# EAGLE board firefly-instrument-tray (EAGLE 7.7.0)
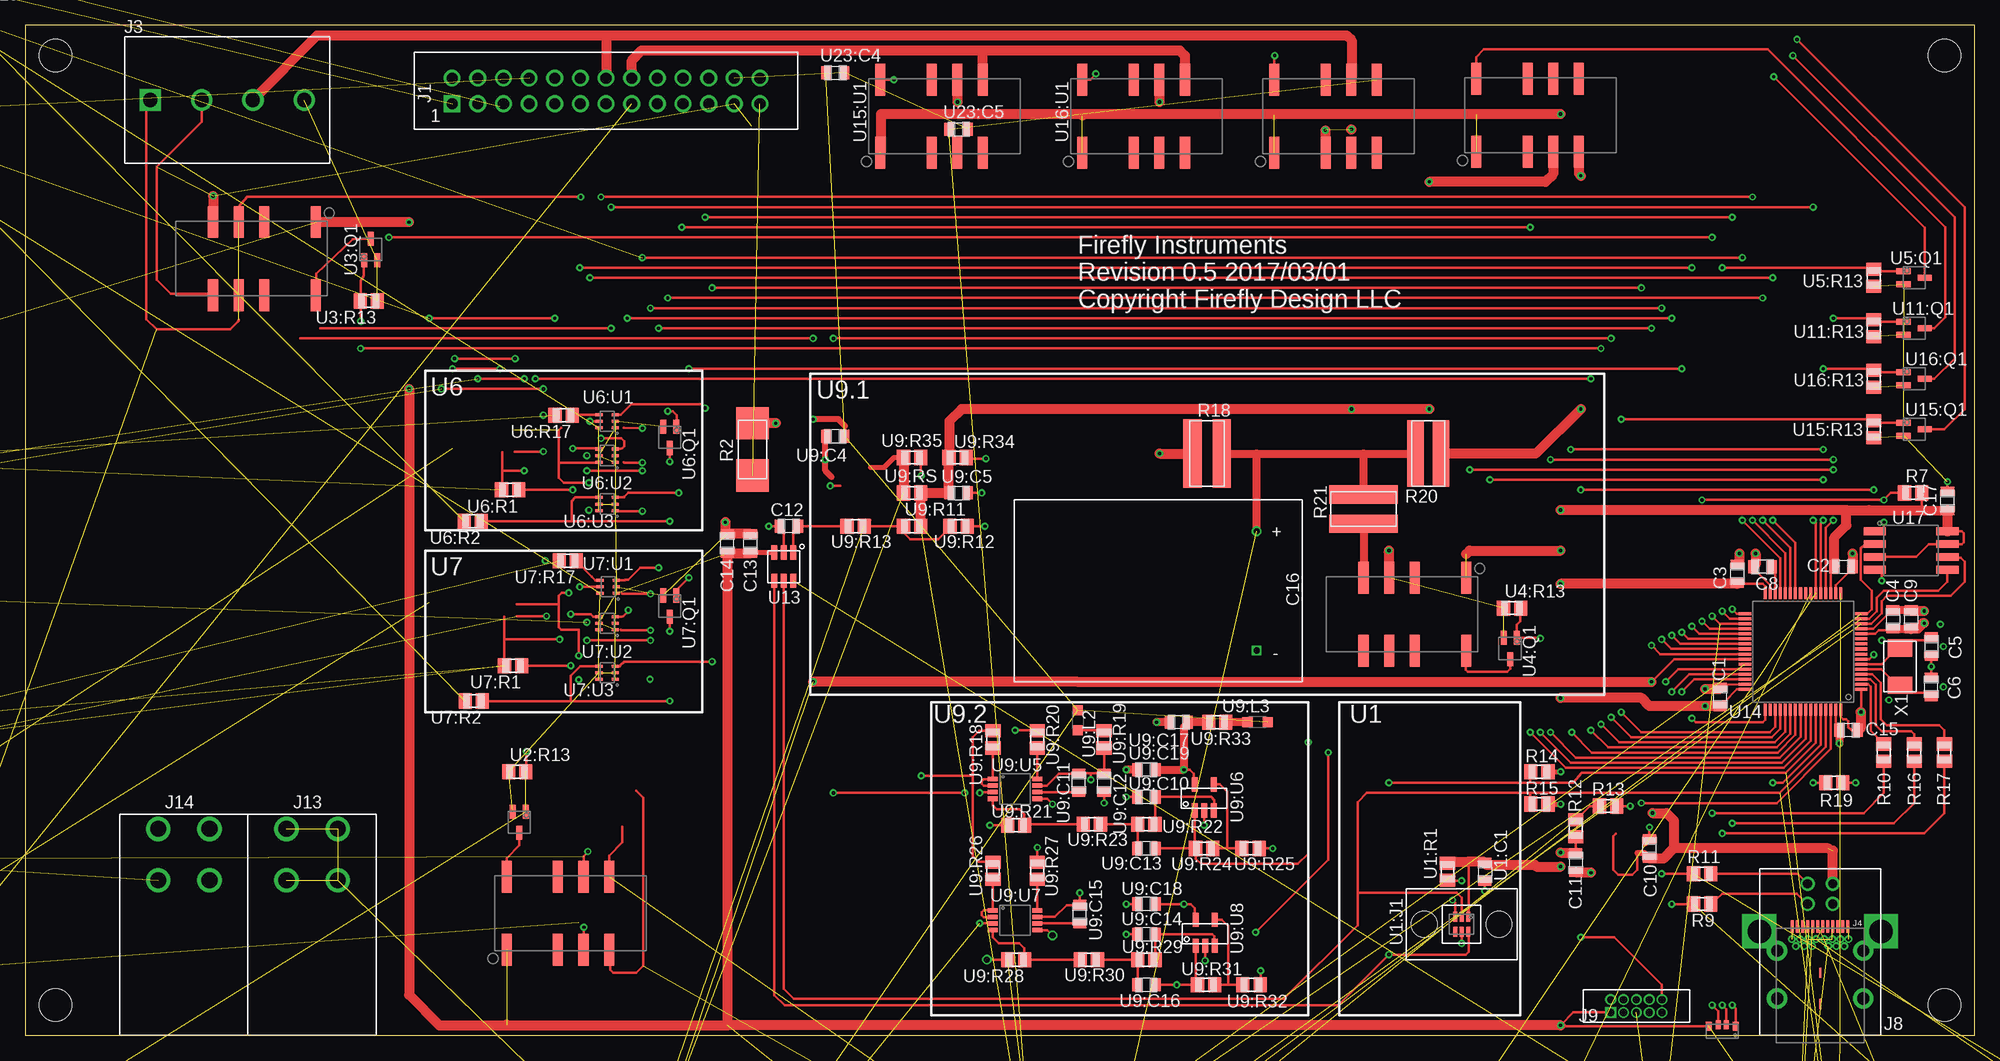
[diagram p14: board, top side]
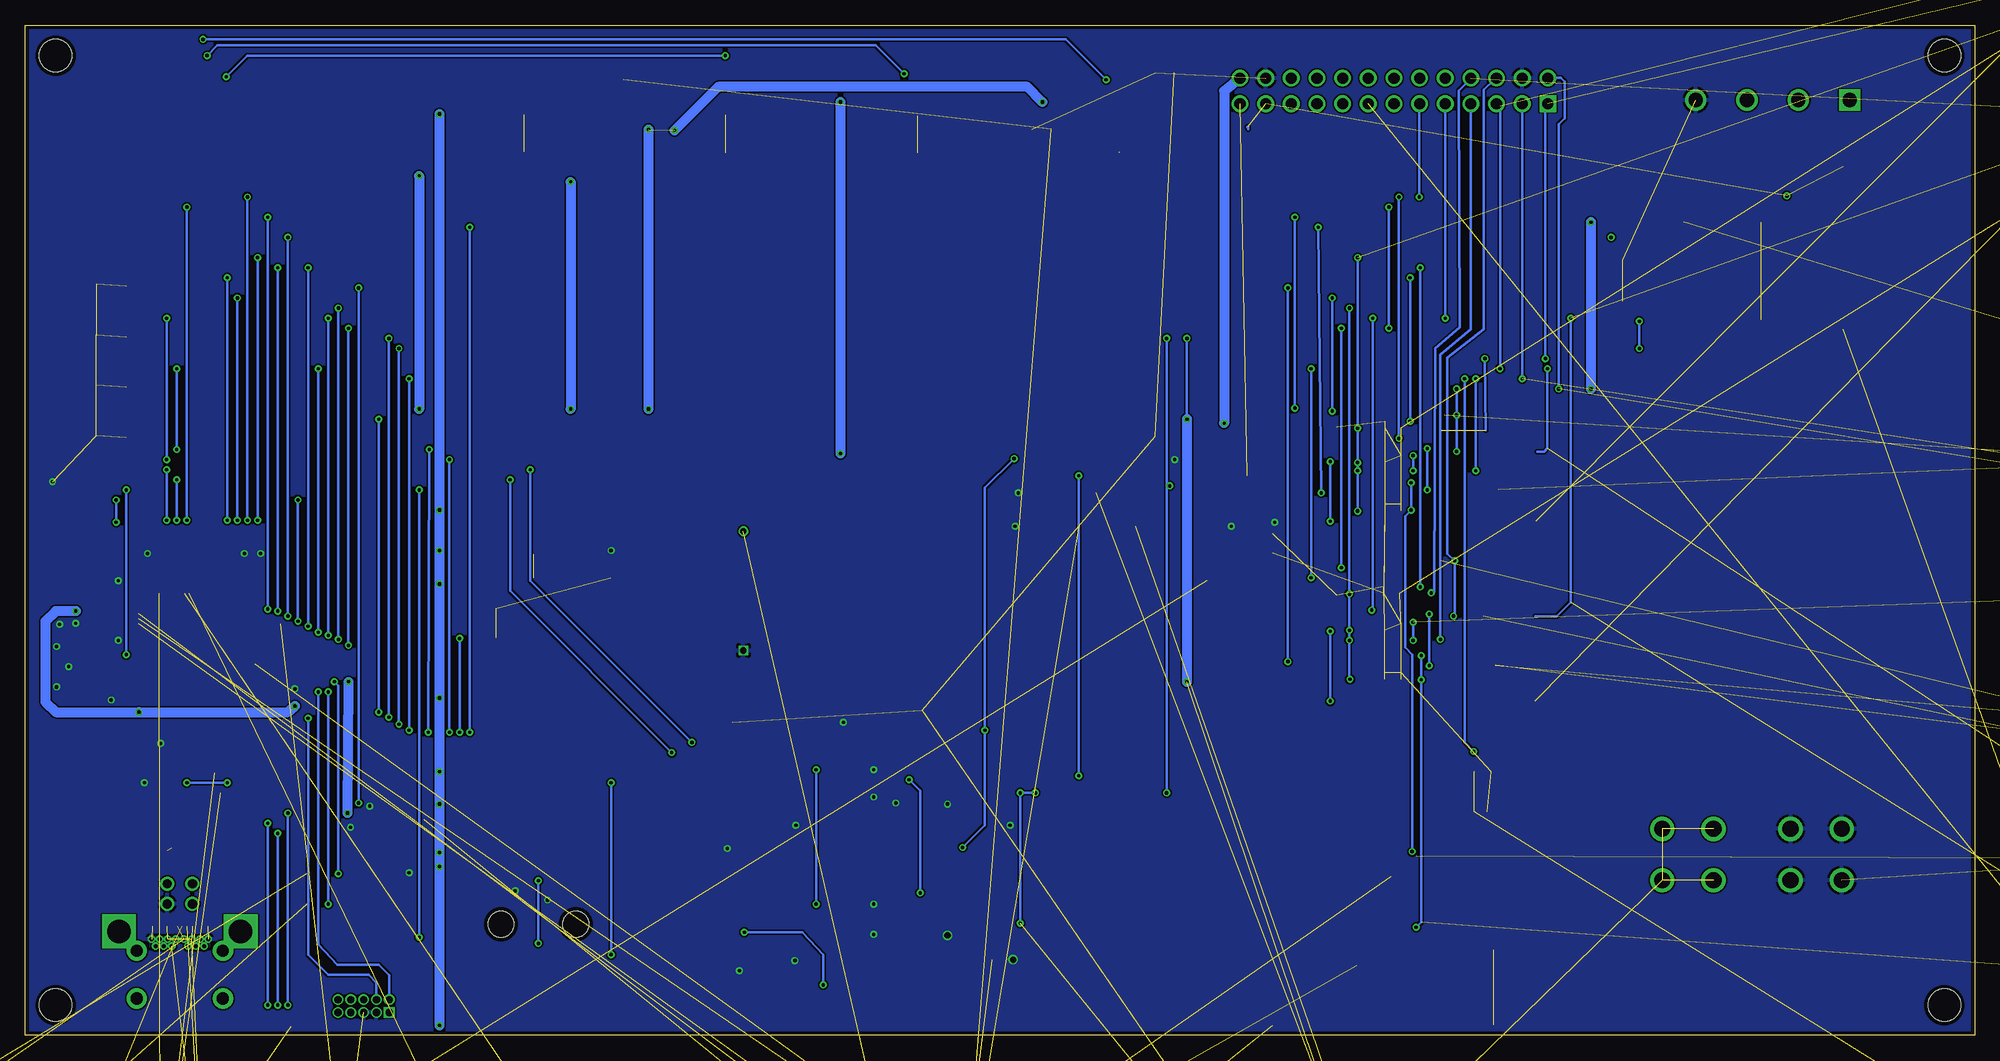
[diagram p15: board, bottom side, seen from below]

Size 193 x 100 mm. Coordinates in mm from the lower left corner, seen from the top.
Outline: 0,0 193,0 193,100 0,100 0,0
Copper layers (1*16): Top 0.0356mm / dielectric 1.5011mm / Bottom 0.0356mm
Design rules "LaenPCBOrder": minimum track width 6mil, minimum drill 13mil, track to track 6mil, track to pad 6mil, pad to pad 6mil, via to via 6mil, smd to smd 6mil, copper to edge 15mil, drill to drill 6mil, minimum pad ring 7mil, minimum via ring 7mil, stop-mask expansion 3mil, vias tented up to drill 0mil, thermal gap 10mil
Holes 3.2 mm at 3,3 3,97 190,3 190,97

## Footprints (pad centres in the part's own frame; a part is rotated, then mirrored left to right if it is on the bottom)
C0805 = smd 0.9 x 1.3: 1 -0.95,0; 2 0.95,0
PM118 = drill 0.6: + 0,-5.9 | drill 0.6 square: - 0,5.9
C1210 = smd 0.9 x 2.5: 1 -1.55,0; 2 1.55,0
C1206 = smd 0.9 x 1.6: 1 -1.55,0; 2 1.55,0
MSL0201RGB = smd 0.6 x 0.9: 1 -1.35,0; 4 1.35,0 | smd 0.5 x 0.9: 2 -0.4,-0.15; 3 0.4,-0.15
DO-214AB = smd 2 x 3.4: A 3.2,0; C -3.2,0
SMM4FXXA = smd 0.85 x 0.65: A 1.64,0 | smd 2.65 x 1.95: C -0.74,0
CON-HEADER-2X13 = drill 1.102 square: 1 -15.24,-1.27 | drill 1.102: 2 -15.24,1.27; 3 -12.7,-1.27; 4 -12.7,1.27; 5 -10.16,-1.27; 6 -10.16,1.27; 7 -7.62,-1.27; 8 -7.62,1.27; 9 -5.08,-1.27; 10 -5.08,1.27; 11 -2.54,-1.27; 12 -2.54,1.27; 13 0,-1.27; 14 0,1.27; 15 2.54,-1.27; 16 2.54,1.27; 17 5.08,-1.27; 18 5.08,1.27; 19 7.62,-1.27; 20 7.62,1.27; 21 10.16,-1.27; 22 10.16,1.27; 23 12.7,-1.27; 24 12.7,1.27; 25 15.24,-1.27; 26 15.24,1.27
282847-4 = drill 1.4 square: 1 -7.62,0 | drill 1.4: 2 -2.54,0; 3 2.54,0; 4 7.62,0
AUSB1-DFN-PTR3 = smd 0.3 x 1.2: A1 -2.75,10.58; A2 -2.25,10.58; A3 -1.75,10.58; A4 -1.25,10.58; A5 -0.75,10.58; A6 -0.25,10.58; A7 0.25,10.58; A8 0.75,10.58; A9 1.25,10.58; A10 1.75,10.58; A11 2.25,10.58; A12 2.75,10.58 | drill 0.4 pad 0.65: B1 2.8,9.33; B2 2.4,8.63; B3 1.6,8.63; B4 1.2,9.33; B5 0.8,8.63; B6 0.4,9.33; B7 -0.4,9.33; B8 -0.8,8.63; B9 -1.2,9.33; B10 -1.6,8.63; B11 -2.4,8.63; B12 -2.8,9.33; GNDP1 2,9.33; GNDP2 -2,9.33 | drill 1.2 pad 2: MP1 4.27,8.18; MP2 4.27,3.45; MP3 -4.27,3.45; MP4 -4.27,8.18 | smd 0.2 x 1: MP5 0,6; MP6 0,2.9
USB-B1HSB6 = drill 0.92: 1 1.25,4.71; 2 -1.25,4.71; 3 -1.25,2.71; 4 1.25,2.71 | drill 2.33 square: MA -6.02,0; MB 6.02,0
SWD-10 = drill 0.7 pad 1 square: 1 -2.54,-0.635 | drill 0.7 pad 1: 2 -2.54,0.635; 3 -1.27,-0.635; 4 -1.27,0.635; 5 0,-0.635; 6 0,0.635; 7 1.27,-0.635; 8 1.27,0.635; 9 2.54,-0.635; 10 2.54,0.635
CT3151 = drill 1.6: 1 -2.54,2.54; 2 -2.54,-2.54; 3 2.54,-2.54; 4 2.54,2.54
SDR0805 = smd 8 x 2.7: 1 0,2.65; 2 0,-2.65
R0805 = smd 1.3 x 1.5: 1 -0.85,0; 2 0.85,0
RW0S6BB = smd 3.18 x 3.2: 1 -2.58,0; 2 2.58,0
RCL1225 = smd 1.8 x 6.8: 1 -1.45,0; 2 1.45,0
KRL6432 = smd 1.65 x 6.6: 1 -1.275,0; 2 1.275,0
SMFLP = hole 2.57: 0,3.7; 0,-3.7
DFN6 = smd 1 x 0.4: 1 -0.75,0.65; 2 -0.75,0; 3 -0.75,-0.65; 4 0.75,-0.65; 5 0.75,0; 6 0.75,0.65
MCPH3 = smd 1.4 x 0.6: 1 -1.05,0.65; 2 -1.05,-0.65; 3 1.05,0
TXS2SA = smd 3.16 x 1: 1 -3.62,6.35; 3 -3.62,1.27; 4 -3.62,-1.27; 5 -3.62,-3.81; 8 3.62,-3.81; 9 3.62,-1.27; 10 3.62,1.27; 12 3.62,6.35
SOT363 = smd 0.7 x 0.3: 1 -0.8,0.65; 2 -0.8,0; 3 -0.8,-0.65; 4 0.8,-0.65; 5 0.8,0; 6 0.8,0.65
R-PDSO-G8 = smd 1.55 x 0.6: 1 -2.7,1.905; 2 -2.7,0.635; 3 -2.7,-0.635; 4 -2.7,-1.905; 5 2.7,-1.905; 6 2.7,-0.635; 7 2.7,0.635; 8 2.7,1.905
L2012C = smd 1 x 1: 1 -1,0; 2 1,0
PPAK = smd 3 x 0.76: 1 -6.65,2.62; 2 -6.65,1.35; 4 -6.65,-1.35; 5 -6.65,-2.62 | smd 6.7 x 6.7: TAB 0,0
MSOP8 = smd 1 x 0.45: 1 -2.2,0.975; 2 -2.2,0.325; 3 -2.2,-0.325; 4 -2.2,-0.975; 5 2.2,-0.975; 6 2.2,-0.325; 7 2.2,0.325; 8 2.2,0.975
SOT-23-5 = smd 1.4 x 0.6: 1 -1.24,0.94; 2 -1.24,-0.01; 3 -1.24,-0.96; 4 1.34,-0.96; 5 1.34,0.94
SOT-23-6 = smd 1.4 x 0.6: 1 -1.4,0.95; 2 -1.4,0; 3 -1.4,-0.95; 4 1.4,-0.95; 5 1.4,0; 6 1.4,0.95
LQFP-64 = smd 1.2 x 0.3: 1 -5.75,3.75; 2 -5.75,3.25; 3 -5.75,2.75; 4 -5.75,2.25; 5 -5.75,1.75; 6 -5.75,1.25; 7 -5.75,0.75; 8 -5.75,0.25; 9 -5.75,-0.25; 10 -5.75,-0.75; 11 -5.75,-1.25; 12 -5.75,-1.75; 13 -5.75,-2.25; 14 -5.75,-2.75; 15 -5.75,-3.25; 16 -5.75,-3.75; 33 5.75,-3.75; 34 5.75,-3.25; 35 5.75,-2.75; 36 5.75,-2.25; 37 5.75,-1.75; 38 5.75,-1.25; 39 5.75,-0.75; 40 5.75,-0.25; 41 5.75,0.25; 42 5.75,0.75; 43 5.75,1.25; 44 5.75,1.75; 45 5.75,2.25; 46 5.75,2.75; 47 5.75,3.25; 48 5.75,3.75 | smd 0.3 x 1.2: 17 -3.75,-5.75; 18 -3.25,-5.75; 19 -2.75,-5.75; 20 -2.25,-5.75; 21 -1.75,-5.75; 22 -1.25,-5.75; 23 -0.75,-5.75; 24 -0.25,-5.75; 25 0.25,-5.75; 26 0.75,-5.75; 27 1.25,-5.75; 28 1.75,-5.75; 29 2.25,-5.75; 30 2.75,-5.75; 31 3.25,-5.75; 32 3.75,-5.75; 49 3.75,5.75; 50 3.25,5.75; 51 2.75,5.75; 52 2.25,5.75; 53 1.75,5.75; 54 1.25,5.75; 55 0.75,5.75; 56 0.25,5.75; 57 -0.25,5.75; 58 -0.75,5.75; 59 -1.25,5.75; 60 -1.75,5.75; 61 -2.25,5.75; 62 -2.75,5.75; 63 -3.25,5.75; 64 -3.75,5.75
SOC008 = smd 2.2 x 0.76: 1 -3.6,1.905; 2 -3.6,0.635; 3 -3.6,-0.635; 4 -3.6,-1.905; 5 3.6,-1.905; 6 3.6,-0.635; 7 3.6,0.635; 8 3.6,1.905
HVQFN20 = smd 0.9 x 0.27: 1 -2.15,1; 2 -2.15,0.5; 3 -2.15,0; 4 -2.15,-0.5; 5 -2.15,-1; 11 2.15,-1; 12 2.15,-0.5; 13 2.15,0; 14 2.15,0.5; 15 2.15,1 | smd 0.27 x 0.9: 6 -1,-2.15; 7 -0.5,-2.15; 8 0,-2.15; 9 0.5,-2.15; 10 1,-2.15; 16 1,2.15; 17 0.5,2.15; 18 0,2.15; 19 -0.5,2.15; 20 -1,2.15 | smd 2.8 x 2.8: PGND 0,0
TSSOP-20 = smd 1.05 x 0.32: 1 -2.9,2.925; 2 -2.9,2.275; 3 -2.9,1.625; 4 -2.9,0.975; 5 -2.9,0.325; 6 -2.9,-0.325; 7 -2.9,-0.975; 8 -2.9,-1.625; 9 -2.9,-2.275; 10 -2.9,-2.925; 11 2.9,-2.925; 12 2.9,-2.275; 13 2.9,-1.625; 14 2.9,-0.975; 15 2.9,-0.325; 16 2.9,0.325; 17 2.9,0.975; 18 2.9,1.625; 19 2.9,2.275; 20 2.9,2.925
TXC_7A = smd 1.7 x 2.4: 1 -1.85,0; 2 1.85,0

## Placement (x,y rotation side)
C1  100nF  [C0805]  167.8,33.5 90 top
C2  100nF  [C0805]  180,46.4 0 top
C3  100nF  [C0805]  169.5,45.7 90 top
C4  1uF  [C0805]  184.9,41.2 270 top
C5  22pF  [C0805]  188.7,38.5 270 top
C6  22pF  [C0805]  188.7,34.5 90 top
C7  2.2uF  [C0805]  not placed on the board
C8  4.7uF  [C0805]  172,46.4 180 top
C9  10nF  [C0805]  186.7,41.2 270 top
C10  1uF  [C0805]  160.8,18.5 90 top
C11  1uF  [C0805]  153.5,17.1 270 top
C12  100nF  [C0805]  75.6,50.4 180 top
C13  100nF  [C0805]  71.8,48.7 90 top
C14  10uF  [C0805]  69.5,48.7 90 top
C15  100nF  [C0805]  180.5,30.2 180 top
C16  1F  [PM118]  121.9,44 180 top
C17  100nF  [C0805]  190.3,52.9 90 top
C18  2.2uF  [C0805]  not placed on the board
C19  100nF  [C0805]  not placed on the board
C20  100nF  [C0805]  not placed on the board
C21  100nF  [C0805]  not placed on the board
C22  4.7uF  [C1210]  not placed on the board
C23  8.2nF  [C0805]  not placed on the board
C24  300pF  [C0805]  not placed on the board
C25  5.6nF  [C0805]  not placed on the board
C26  100nF  [C0805]  not placed on the board
C27  47uF  [C1206]  not placed on the board
C28  4.7uF  [C1210]  not placed on the board
C29  2.2uF  [C0805]  not placed on the board
C30  2.2uF  [C0805]  not placed on the board
C31  100nF  [C0805]  not placed on the board
C32  100nF  [C0805]  not placed on the board
C33  10uF  [C0805]  not placed on the board
C34  2.2uF  [C0805]  not placed on the board
C35  2.2uF  [C0805]  not placed on the board
C36  4.7uF  [C1210]  not placed on the board
C37  8.2nF  [C0805]  not placed on the board
C38  300pF  [C0805]  not placed on the board
C39  5.6nF  [C0805]  not placed on the board
C40  100nF  [C0805]  not placed on the board
C41  47uF  [C1206]  not placed on the board
C42  4.7uF  [C1210]  not placed on the board
C43  100nF  [C0805]  not placed on the board
C44  10uF  [C0805]  not placed on the board
C45  100nF  [C0805]  not placed on the board
C46  10uF  [C0805]  not placed on the board
C47  100nF  [C0805]  not placed on the board
C48  10uF  [C0805]  not placed on the board
C49  2.2uF  [C0805]  not placed on the board
C50  1uF  [C0805]  not placed on the board
D1  LED-RGB-CAMSL0201RGB  [MSL0201RGB]  168,0.9 180 top
D2  D-USDO-214AB  [DO-214AB]  not placed on the board
D3  D-USSMM4FXXA  [SMM4FXXA]  not placed on the board
D4  D-USSMM4FXXA  [SMM4FXXA]  not placed on the board
D5  D-USSMM4FXXA  [SMM4FXXA]  not placed on the board
D6  D-USSMM4FXXA  [SMM4FXXA]  not placed on the board
D7  D-USDO-214AB  [DO-214AB]  not placed on the board
J1  CON-26  [CON-HEADER-2X13]  57.5,93.5 0 top
J3  CON-4282847-4  [282847-4]  20,92.6 0 top
J4  USB-CAUSB1-DFN-PTR3  [AUSB1-DFN-PTR3]  177.7,0.2 0 top
J8  USB-4PINUSB-B1HSB6  [USB-B1HSB6]  177.7,10.3 0 top
J9  CON-10SWD  [SWD-10]  159.5,2.9 0 top
J13  CON-1CT3151  [CT3151]  28.4,17.9 180 top
J14  CON-1CT3151  [CT3151]  15.7,17.9 180 top
L1  6.8uH  [SDR0805]  not placed on the board
L2  6.8uH  [SDR0805]  not placed on the board
R1  169k  [R0805]  not placed on the board
R2  100  [RW0S6BB]  72,58 270 top
R7  10k  [R0805]  186.9,53.7 0 top
R8  22  [R0805]  not placed on the board
R9  22  [R0805]  166,13 0 top
R10  60  [R0805]  184,28 90 top
R11  22  [R0805]  166,16 0 top
R12  72.5k  [R0805]  153.5,20.5 270 top
R13  10K  [R0805]  156.7,22.7 180 top
R14  4.7k  [R0805]  149.9,26.1 0 top
R15  4.7k  [R0805]  149.9,22.9 0 top
R16  60  [R0805]  187,28 90 top
R17  240  [R0805]  190,28 90 top
R18  1 (2W WW)  [RCL1225]  117,57.6 0 top
R19  0  [R0805]  179.1,25 0 top
R20  49.9 (2W WW)  [KRL6432]  138.9,57.6 180 top
R21  49.9 (2W WW)  [RCL1225]  132.5,52.1 90 top
R22  22  [R0805]  not placed on the board
R23  10K  [R0805]  not placed on the board
R24  169k  [R0805]  not placed on the board
R25  29.4k  [R0805]  not placed on the board
R26  43  [R0805]  not placed on the board
R27  1  [R0805]  not placed on the board
R28  10.2k  [R0805]  not placed on the board
R29  3.28k  [R0805]  not placed on the board
R30  76.8k  [R0805]  not placed on the board
R31  43  [R0805]  not placed on the board
R32  29.4k  [R0805]  not placed on the board
R33  1  [R0805]  not placed on the board
R34  10.2k  [R0805]  not placed on the board
R35  1.6k  [R0805]  not placed on the board
R36  76.8k  [R0805]  not placed on the board
R37  10.2k  [R0805]  not placed on the board
R38  1.47k  [R0805]  not placed on the board
U1:C1  1uF  [C0805]  144.5,16.2 270 top
U1:J1  SMFLP  [SMFLP]  142.2,11 90 top
U1:R1  10k  [R0805]  140.8,16.2 90 top
U1:U1  TCS3471  [DFN6]  142.2,11 270 top
U2:Q1  FET-NMCPH3  [MCPH3]  48.9,21.1 270 top
U2:R13  10K  [R0805]  48.7,26.1 0 top
U2:U1  TXS2SA  [TXS2SA]  54,12.1 90 top
U3:Q1  FET-NMCPH3  [MCPH3]  34.2,77.8 90 top
U3:R13  10K  [R0805]  34,72.7 180 top
U3:U1  TXS2SA  [TXS2SA]  22.4,76.9 270 top
U4:Q1  FET-NMCPH3  [MCPH3]  147,38.3 270 top
U4:R13  10K  [R0805]  147.2,42.3 0 top
U4:U1  TXS2SA  [TXS2SA]  136.3,41.7 270 top
U5:Q1  FET-NMCPH3  [MCPH3]  187,75 0 top
U5:R13  10K  [R0805]  183,75 90 top
U5:U1  TXS2SA  [TXS2SA]  130,91 90 top
U6:J7  CON-10SWD  [SWD-10]  not placed on the board
U6:Q1  FET-NMCPH3  [MCPH3]  63.8,59.2 270 top
U6:R1  240  [R0805]  48,54 180 top
U6:R2  240  [R0805]  44.3,50.9 180 top
U6:R17  240  [R0805]  53.3,61.4 180 top
U6:U1  74LVCH1T45  [SOT363]  57.6,60.8 180 top
U6:U2  74LVCH1T45  [SOT363]  57.6,57.4 180 top
U6:U3  74LVCH1T45  [SOT363]  57.6,52.6 180 top
U6:U4:Q1  FET-NMCPH3  [MCPH3]  not placed on the board
U6:U4:R13  10K  [R0805]  not placed on the board
U6:U4:U1  TXS2SA  [TXS2SA]  not placed on the board
U6:U5:Q1  FET-NMCPH3  [MCPH3]  not placed on the board
U6:U5:R13  10K  [R0805]  not placed on the board
U6:U5:U1  TXS2SA  [TXS2SA]  not placed on the board
U7:J7  CON-10SWD  [SWD-10]  not placed on the board
U7:Q1  FET-NMCPH3  [MCPH3]  63.8,42.5 270 top
U7:R1  240  [R0805]  48.3,36.6 180 top
U7:R2  240  [R0805]  44.4,33.1 180 top
U7:R17  240  [R0805]  53.7,47 180 top
U7:U1  74LVCH1T45  [SOT363]  57.7,44.4 180 top
U7:U2  74LVCH1T45  [SOT363]  57.6,40.8 180 top
U7:U3  74LVCH1T45  [SOT363]  57.6,35.9 180 top
U7:U4:Q1  FET-NMCPH3  [MCPH3]  not placed on the board
U7:U4:R13  10K  [R0805]  not placed on the board
U7:U4:U1  TXS2SA  [TXS2SA]  not placed on the board
U7:U5:Q1  FET-NMCPH3  [MCPH3]  not placed on the board
U7:U5:R13  10K  [R0805]  not placed on the board
U7:U5:U1  TXS2SA  [TXS2SA]  not placed on the board
U8  TPS54232  [R-PDSO-G8]  not placed on the board
U9:C4  1uF  [C0805]  80.2,59.3 180 top
U9:C5  1uF  [C0805]  92.4,53.7 0 top
U9:C10  1nF  [C0805]  111,23.6 180 top
U9:C11  100nF  [C0805]  104.3,25 90 top
U9:C12  10uF  [C0805]  106.8,25 270 top
U9:C13  1nF  [C0805]  111,18.5 180 top
U9:C14  1nF  [C0805]  111,10 180 top
U9:C15  100nF  [C0805]  104.4,12 90 top
U9:C16  1nF  [C0805]  111,5 180 top
U9:C17  1uF  [C0805]  114.2,31 180 top
U9:C18  100nF  [C0805]  111,13 180 top
U9:C19  100nF  [C0805]  111,26.3 180 top
U9:L2  1k  [L2012C]  104.2,31.2 270 top
U9:L3  1k  [L2012C]  122,31 180 top
U9:R11  650K  [R0805]  87.8,50.4 0 top
U9:R12  100K  [R0805]  92.4,50.4 180 top
U9:R13  100K  [R0805]  82.2,50.4 0 top
U9:R18  1.8K  [R0805]  95.8,29.3 90 top
U9:R19  0  [R0805]  106.8,29.3 90 top
U9:R20  43  [R0805]  100.2,29.3 270 top
U9:R21  12K  [R0805]  98.1,20.8 180 top
U9:R22  10k  [R0805]  111,20.9 0 top
U9:R23  10k  [R0805]  105.6,20.9 0 top
U9:R24  376  [R0805]  116.7,18.5 180 top
U9:R25  1K  [R0805]  121.3,18.5 0 top
U9:R26  4.7  [R0805]  95.8,16.3 90 top
U9:R27  0  [R0805]  100.2,16.3 270 top
U9:R28  10K  [R0805]  98.1,7.5 180 top
U9:R29  10k  [R0805]  111,7.5 0 top
U9:R30  10k  [R0805]  105.3,7.5 0 top
U9:R31  0  [R0805]  116.9,5 180 top
U9:R32  1K  [R0805]  121.4,5 0 top
U9:R33  1  [R0805]  118,31 0 top
U9:R34  0  [R0805]  92.3,57.2 180 top
U9:R35  0  [R0805]  87.8,57.2 180 top
U9:RS  4.7  [R0805]  87.8,53.7 0 top
U9:U2  VREG-ADJLDFMPT-TR  [PPAK]  not placed on the board
U9:U5  LTC6102-1MS8  [MSOP8]  98,24.4 0 top
U9:U6  TLV271SN2T1G  [SOT-23-5]  116.7,23.5 90 top
U9:U7  LTC6102-1MS8  [MSOP8]  98,11.4 0 top
U9:U8  TLV271SN2T1G  [SOT-23-5]  116.8,10.1 90 top
U10:Q1  FET-NMCPH3  [MCPH3]  not placed on the board
U10:R13  10K  [R0805]  not placed on the board
U10:U1  TXS2SA  [TXS2SA]  not placed on the board
U11:Q1  FET-NMCPH3  [MCPH3]  187,70 0 top
U11:R13  10K  [R0805]  183,70 90 top
U11:U1  TXS2SA  [TXS2SA]  150,91.1 90 top
U12  VREG-ADJAP7331-WG-7  [SOT-23-5]  not placed on the board
U13  MCP47X6  [SOT-23-6]  75.1,46.4 270 top
U14  STM32F411-LQFP64  [LQFP-64]  176,38 180 top
U15:Q1  FET-NMCPH3  [MCPH3]  187,60 0 top
U15:R13  10K  [R0805]  183,60 90 top
U15:U1  TXS2SA  [TXS2SA]  91,91 90 top
U16:Q1  FET-NMCPH3  [MCPH3]  187,65 0 top
U16:R13  10K  [R0805]  183,65 90 top
U16:U1  TXS2SA  [TXS2SA]  111,91 90 top
U17  MEMORY-SPISOC008  [SOC008]  186.7,48 0 top
U18  PTN5100  [HVQFN20]  not placed on the board
U19  TPS54232  [R-PDSO-G8]  not placed on the board
U20  MCP1501  [SOT-23-6]  not placed on the board
U21  MCP47X6  [SOT-23-6]  not placed on the board
U22  MCP1501  [SOT-23-6]  not placed on the board
U23:C4  1uF  [C0805]  80.2,95.3 0 top
U23:C5  1uF  [C0805]  92.4,89.7 0 top
U23:C10  1nF  [C0805]  not placed on the board
U23:C11  100nF  [C0805]  not placed on the board
U23:C12  10uF  [C0805]  not placed on the board
U23:C13  1nF  [C0805]  not placed on the board
U23:C14  1nF  [C0805]  not placed on the board
U23:C15  100nF  [C0805]  not placed on the board
U23:C16  1nF  [C0805]  not placed on the board
U23:C17  1uF  [C0805]  not placed on the board
U23:C18  100nF  [C0805]  not placed on the board
U23:C19  100nF  [C0805]  not placed on the board
U23:L2  1k  [L2012C]  not placed on the board
U23:L3  1k  [L2012C]  not placed on the board
U23:R11  650K  [R0805]  not placed on the board
U23:R12  100K  [R0805]  not placed on the board
U23:R13  100K  [R0805]  not placed on the board
U23:R18  1.8K  [R0805]  not placed on the board
U23:R19  0  [R0805]  not placed on the board
U23:R20  43  [R0805]  not placed on the board
U23:R21  12K  [R0805]  not placed on the board
U23:R22  10k  [R0805]  not placed on the board
U23:R23  10k  [R0805]  not placed on the board
U23:R24  376  [R0805]  not placed on the board
U23:R25  1K  [R0805]  not placed on the board
U23:R26  4.7  [R0805]  not placed on the board
U23:R27  0  [R0805]  not placed on the board
U23:R28  10K  [R0805]  not placed on the board
U23:R29  10k  [R0805]  not placed on the board
U23:R30  10k  [R0805]  not placed on the board
U23:R31  0  [R0805]  not placed on the board
U23:R32  1K  [R0805]  not placed on the board
U23:R33  1  [R0805]  not placed on the board
U23:R34  0  [R0805]  not placed on the board
U23:R35  0  [R0805]  not placed on the board
U23:RS  4.7  [R0805]  not placed on the board
U23:U2  VREG-ADJLDFMPT-TR  [PPAK]  not placed on the board
U23:U5  LTC6102-1MS8  [MSOP8]  not placed on the board
U23:U6  TLV271SN2T1G  [SOT-23-5]  not placed on the board
U23:U7  LTC6102-1MS8  [MSOP8]  not placed on the board
U23:U8  TLV271SN2T1G  [SOT-23-5]  not placed on the board
U24  AD7327  [TSSOP-20]  not placed on the board
U25  VREG-ADJAP2204  [SOT-23-5]  not placed on the board
X1  XTAL2TXC_7A  [TXC_7A]  185.6,36.5 90 top

## Tracks (layer width: path | path; a pad name or v marks a point on that pad's centre or on a via)
+3V3  (via drill 0.33)  (45 unrouted)
  Top 0.254: U1:U1.1 142.85,12.35 142.9,12.4 142.9,17.2 | U1:R1.2 140.85,17.2 | 144.3,17.2 U1:C1.1 144.55,16.95 144.6,16.9 | 71.85,47.8 C13.1 | C11.1 | C11.1 R12.2 153.35,19.65 153.2,19.5 | U14.1 v181.75,32 | U14.13 182.95,40.25 184.8,42.1 C4.1 | U14.48 169.45,34.25 168.3,33.1 168.05,33.1 C1.1 167.75,32.55 167.7,32.6 | U14.19 178.75,46.15 179,46.4 C2.1 179.1,46.45 | J9.1 153.26,2.27 v152,1 152,1.4 152.5,0.9 D1.4 | 153.5,18.1 C11.1 | U14.32 172.25,44.45 172,44.7 169.55,44.7 C3.1 169.45,44.7 | 186.85,42 C9.1 | U14.64 179.75,31.55 180,31.3 180.3,31.3 180.5,31.1 180.5,30.5 180.8,30.2 C15.1 | U17.8 191.69,49.91 191.9,49.7 191.9,48.8 191.7,48.6 190.34,48.6 U17.7 188.44,48.63 187.2,47.4 185.13,47.4 U17.3 | R7.2 187.75,52.01 187.8,51.97
  Top 0.5: U13.3 71.85,47.8 | R15.2 v152,22.9 | R14.2 v152,26.1
  Top 0.813: C4.1 C9.1
  Top 1: 140.85,17.2 142.9,17.2 144.3,17.2 | 47.7,1 41,1 38,4 v38,64 | 47.7,1 69.5,1 | v152,1 69.5,1 | 144.6,16.9 149.4,16.9 149.6,16.7 v152,16.7 | C13.1 C14.1 69.5,1 | v152,18.1 153.5,18.1 | 167.7,32.6 v166.3,32.6 160.8,32.6 160,33.4 v152,33.4 | v181.75,32 181.7,32 181.7,30.4 C15.1 | v188,42 186.85,42 | 179.1,46.45 179.1,49.3 180.3,50.5 180.3,52 | 180.3,52 v152,52 | 169.45,44.7 v152,44.7 | 47.65,1.05 47.7,1 | v38,80.5 28.8,80.5 | U17.8 C17.1 187.8,51.97 182.55,52 180.3,52 | v152,91.2 143.7,91.2 | 143.7,91.2 123.7,91.2 | 123.7,91.2 104.5,91.2 | 104.5,91.2 84.7,91.2 84.7,87.43 | 104.65,91.05 104.5,91.2 | 123.65,91.15 123.7,91.2 | 143.65,91.15 143.7,91.2 | 142.65,47.65 143,48 v152,48
  Bottom 0.254: 152,51.7 v152,52
  Bottom 1: v152,1 v152,16.7 v152,18.1 v152,22.9 v152,26.1 v152,33.4 v152,44.7 v152,48 v152,52 v152,91.2 | v166.3,32.6 167,32 v181.75,32 190,32 191,33 191,41 190,42 v188,42 | v38,80.5 v38,64
+5V9  (10 unrouted)
+12V  (14 unrouted)
ADC_CSN  (1 unrouted)
ATE_BAT_ADJ_EN  (via drill 0.33)
  Top 0.254: U14.51 173.25,30.55 172.7,30 160,30 v158,32 | v158,61 182.85,61 U15:R13.2 183.2,60.65 U15:Q1.1
  Bottom 0.254: v158,32 v158,61
ATE_BAT_CAP_EN  (via drill 0.33)
  Top 0.254: U14.55 175.25,29.75 173.5,28 155.1,28 v153.1,30 | U16:Q1.1 183.2,65.65 U16:R13.2 182.85,66 v178,66 | v153,58 v178,58
  Bottom 0.254: v153.1,30 v153,58 | v178,58 v178,66
ATE_BS_ADJ
  Top 0.254: U13.1 76.05,49.9 C12.1 U9:R13.1
ATE_BS_EN  (via drill 0.33)  (1 unrouted)
  Top 0.254: U9:U5.3 94.7,24.07 94.7,24 v94.5,24 | v94.5,11.1 95.78,11.1 U9:U7.3 | v93,24 v80,24 | v157,69 v80,69 | v157,31.5 159,29.5 172.9,29.5 173.75,30.35 U14.52 | 80.7,54.4 v79.7,54.4
  Bottom 0.254: v94.5,11.1 v94.5,24 v93,24 | v80,24 80,54.4 | 80,54.4 v80,69 | v157,31.5 v157,69 | v79.7,54.4 80,54.4
ATE_BS_SHR  (via drill 0.33)
  Top 0.254: U9:C13.1 U9:R24.2 | U9:R24.2 115.9,18.5 115.9,17.5 116.4,17 126,17 127,18 v127,29 | v143,56 v179,56 | U14.20 178.25,50.25 v179,51 | U9:U6.1 115.76,18.59 U9:R24.2
  Bottom 0.254: v143,56 143,45 v127,29 | v179,51 v179,56
ATE_BS_SLR  (via drill 0.33)
  Top 0.254: U9:C16.1 v114,5 U9:R31.2 115.86,5.19 U9:U8.1 | v129,28 129,17.4 v121.8,10.2 | v145,55 v178,55 | U14.21 177.75,50.75 v178,51
  Bottom 0.254: v145,55 145,44 v129,28 | v121.8,10.2 116.1,10.2 114,8 v114,5 | v178,51 v178,55
ATE_BUTTON+  (1 unrouted)
ATE_BUTTON_EN  (via drill 0.33)
  Top 0.254: v156,68 v33.2,68 | U3:Q1.1 33.5,76.6 33.5,75.2 33.2,74.7 33.2,72.75 U3:R13.2 33.2,72.65 v33.2,70.7 | U14.53 174.25,30.05 173.2,29 157.8,29 v156,30.8
  Bottom 0.254: v156,30.8 v156,68 | v33.2,68 v33.2,70.7
ATE_DRAIN_EN  (via drill 0.33)
  Top 0.254: U14.57 176.25,29.35 173.9,27 153,27 v150,30 | U4:R13.2 148,42.25 148,41 147.65,40.65 U4:Q1.1 149.95,39.35 v150,39.3
  Bottom 0.254: v150,39.3 v150,30
ATE_FILL_EN  (via drill 0.33)
  Top 0.254: U14.56 175.75,29.55 173.7,27.5 153.5,27.5 v151,30 | U11:Q1.1 183.2,70.65 U11:R13.2 182.85,71 v179,71 | v151,57 v179,57
  Bottom 0.254: v151,57 v151,30 | v179,57 v179,71
ATE_MCU1_VCC  (1 unrouted)
  Top 0.254: U2:U1.8 57.8,17.8 59.1,19.1 59.1,20.65
ATE_MCU2_VCC  (1 unrouted)
  Top 0.254: 60.5,24.2 61.2,23.5 61.2,6.9 60.5,6.2 58.2,6.2 57.9,6.5 57.9,8.37 U2:U1.5
ATE_SWD1_DIR_TO_DUT  (via drill 0.33)
  Top 0.254: v55.9,60.8 U6:U1.5 | v55.9,75 v173,75 | U14.26 175.25,48.75 v173,51
  Bottom 0.254: v55.9,75 v55.9,60.8 | v173,51 v173,75
ATE_SWD1_NRESET  (via drill 0.33)
  Top 0.254: v63.6,61.8 64.1,61.8 64.5,61.4 64.5,60.35 U6:Q1.1 | v63.6,73 v172,73 | U14.27 174.75,48.25 v172,51
  Bottom 0.254: v63.6,73 v63.6,61.8 | v172,51 v172,73
ATE_SWD1_PWR  (via drill 0.33)  (4 unrouted)
  Top 0.254: 59.25,60.15 v61.1,60.1 | 59.25,56.75 59.3,56.7 v61.1,56.7 | v55.6,55.9 v61.1,55.9 | v61.1,77 v170,77 | U14.29 173.75,47.25 v170,51 | v61.1,51.9 58.45,51.9
  Bottom 0.254: v55.6,57.4 v55.6,55.9 | v61.1,77 v61.1,60.1 v61.1,56.7 v61.1,55.9 v61.1,51.9 | v170,51 v170,77
ATE_SWD1_SENSE_NRESET  (via drill 0.33)
  Top 0.254: U6:U3.3 59.15,53.25 arc45 59.32,53.32 59.7,53.7 v64.7,53.7 | v65,80 v149,80 | U14.58 176.75,29.15 174.1,26.5 152.5,26.5 v149,30
  Bottom 0.254: v64.7,53.7 v65,80 | v149,30 v149,80
ATE_SWD1_SWDCLK  (via drill 0.33)
  Top 0.254: v57,59.1 59,59.1 59.3,58.8 59.3,58.3 59.1,58.1 58.95,58.05 U6:U2.3 | v57,83 v171,83 | U14.28 174.25,47.75 v171,51
  Bottom 0.254: v57,83 v57,59.1 | v171,51 v171,83
ATE_SWD1_SWDIO  (via drill 0.33)
  Top 0.254: v67.3,62.1 66.9,62.5 60,62.5 58.95,61.45 U6:U1.3 | v67.3,81 v169,81 | U14.33 169.45,41.75 v169,42.2
  Bottom 0.254: v67.3,81 v67.3,62.1 | v169,42.2 v169,81
ATE_SWD2_DIR_TO_DUT  (via drill 0.33)
  Top 0.254: v54.9,44.4 U7:U1.5 | v54.9,76 v165,76 | U14.37 165.75,39.75 v165,40.5
  Bottom 0.254: v54.9,76 v54.9,44.4 | v165,40.5 v165,76
ATE_SWD2_NRESET  (via drill 0.33)
  Top 0.254: v65.7,45.3 64.5,44.1 64.5,43.35 U7:Q1.1 | v65.7,66 v164,66 | U14.38 164.65,39.25 v164,39.9
  Bottom 0.254: v65.7,66 v65.7,45.3 | v164,39.9 v164,66
ATE_SWD2_PWR  (via drill 0.33)  (4 unrouted)
  Top 0.254: 55.7,40.8 v55.6,40.9 | v55.6,39.1 v61.9,39.1 | v61.9,43.7 59.1,43.7 59.05,43.75 | 58.95,40.15 59,40.1 v61.9,40.1 | v61.9,72 v162,72 | U14.40 162.95,38.25 v162,39.2
  Bottom 0.254: v55.6,40.9 v55.6,39.1 | v61.9,72 v61.9,43.7 v61.9,40.1 v61.9,39.1 61.9,35.3 v61.85,35.25 | v162,39.2 v162,72
ATE_SWD2_SENSE_NRESET  (via drill 0.33)
  Top 0.254: U7:U3.3 58.74,36.55 arc45 58.92,36.62 59.3,37 v68,37 | v68,74 v160,74 | U14.62 178.75,28.35 173.4,23 v160,23
  Bottom 0.254: v68,37 v68,74 | v160,74 v160,23
ATE_SWD2_SWDCLK  (via drill 0.33)
  Top 0.254: v59.7,42.1 59.7,42 59.2,41.5 59.05,41.45 U7:U2.3 | v59.6,71 v163,71 | U14.39 163.85,38.75 v163,39.6
  Bottom 0.254: v59.6,71 59.6,42.2 v59.7,42.1 | v163,39.6 v163,71
ATE_SWD2_SWDIO  (via drill 0.33)
  Top 0.254: v62.7,46.3 60.9,46.3 59.7,45.1 59.4,45.1 59.35,45.05 U7:U1.3 | v62.7,70 v161,70 | U14.41 161.85,37.75 v161,38.6
  Bottom 0.254: v62.7,70 v62.7,46.3 | v161,38.6 v161,70
ATE_USB_5V_EN  (via drill 0.33)
  Top 0.254: U14.34 168.75,41.25 v168,42 | U5:Q1.1 183.2,75.65 U5:R13.2 182.85,76 v168,76
  Bottom 0.254: v168,42 v168,76
ATE_USB_ADJ  (2 unrouted)
ATE_USB_EN  (via drill 0.33)  (3 unrouted)
  Top 0.254: v36,79 v167,79 | U14.35 167.75,40.75 v167,41.5
  Bottom 0.254: v167,41.5 v167,79
ATE_USB_SHR  (via drill 0.33)  (3 unrouted)
  Top 0.254: 29.2,70 v58,70 | v58,82 176.9,82 177,81.9 v177,82 | U14.22 177.25,50.75 v177,51
  Bottom 0.254: v58,70 v58,82 | v177,51 v177,82
ATE_USB_SLR  (3 unrouted)
ATE_VB  (1 unrouted)
ATE_VSENSE  (via drill 0.33)  (4 unrouted)
  Top 0.254: v50.5,65 v155,65 | U14.54 174.75,29.85 173.4,28.5 156.7,28.5 v155,30.2 | v49.6,28.1 49.6,26.15
  Bottom 0.254: v155,30.2 v155,65 | v50.5,65 50.5,29 v49.6,28.1
BATADJ  (via drill 0.33)  (2 unrouted)
  Top 1: U9:R11.2 U9:RS.2 U9:C5.1 U9:R34.2 91.5,57.25 91.5,60.8 92.7,62 v131.3,62 v139,62 | 131.27,89.67 v131.3,89.7 | U11:U1.4 151.27,85.27 150.5,84.5 v139,84.5 | U15:U1.9 92.27,92.43 v92.3,92.4 | v128.7,89.6 128.7,87.41
  Bottom 1: v131.3,89.7 v131.3,62 | v139,84.5 v139,62 | v92.3,92.4 93.8,93.9 124.4,93.9 v128.7,89.6
BATCAP  (via drill 0.33)
  Top 1: U16:U1.9 112.27,92.43 v112.3,92.4 | v112.3,57.6 R18.1
  Bottom 1: v112.3,92.4 v112.3,57.6
BATCAPV  (1 unrouted)
  Top 0.813: R18.2 121.9,57.6 | 121.9,57.6 132.5,57.6 | 132.5,57.6 R20.2 | C16.+ 121.9,57.6 | R21.2 132.5,57.6
BOOT0  (via drill 0.33)
  Top 0.254: U14.60 177.75,28.75 174,25 v173,25 | v177,25 R19.1
  Bottom 0.254: v173,25 v177,25
DRAINCAP
  Top 0.813: R21.1 U4:U1.5
DUT_BATTERY+
  Top 1: 94.8,97.5 114.3,97.5 114.8,97 U16:U1.8 | 94.8,97.5 61,97.5 60,96.43 J1.16 | U15:U1.8 94.81,97.49 94.8,97.5
DUT_BUTTON+  (via drill 0.33)  (2 unrouted)
  Top 0.254: 21.1,80.55 U3:U1.4 arc-45 21.1,80.59 21.1,82 22,83 v55,83 | 21.13,70.83 arc-45 21.06,70.66 20.3,69.9 13,69.9 12,70.9 12,91.48 J3.1
  Bottom 0.254: v55,83 55,92.19 J1.11
DUT_BUTTON-  (via drill 0.33)  (3 unrouted)
  Top 0.254: 18.5,80.53 U3:U1.5 | J3.2 17.46,90.46 13,86 13,74.8 14.4,73.4 18.3,73.4 arc-9 18.43,73.34
  Top 1: v18.6,83.1 U3:U1.5
  Bottom 0.254: 71.92,89.72 71.92,90 72,89.9
DUT_MCU1_NRESET  (via drill 0.33)  (2 unrouted)
  Top 0.254: v47,66 v42.3,66
  Bottom 0.254: J1.5 47,92 v47,66 | v42.3,66 42.3,58.1 42.6,57.8 43.33,57.8
DUT_MCU1_SWDCLK  (via drill 0.33)  (2 unrouted)
  Top 0.254: v49.4,55.9 47.2,55.9 | 47.2,55.9 47.2,57.73 | v44.8,65 v49.4,65 | 47.2,55.9 47.2,53.55
  Bottom 0.254: J1.3 v44.8,65 | v49.4,65 v49.4,55.9
DUT_MCU1_SWDIO  (via drill 0.33)  (2 unrouted)
  Top 0.254: v51.3,57.8 48.48,57.8 | v51.3,64 v41.2,64
  Bottom 0.254: v51.3,64 v51.3,61.4 v51.3,57.8 | v41.2,64 41.2,90.2 40.6,90.8 40.6,94.4 41,94.8 42.13,94.8 J1.2
DUT_MCU1_VCC  (via drill 0.33)  (3 unrouted)
  Top 0.254: 53.05,60.15 52.8,59.9 52.8,56.7 | 56.55,56.75 56.5,56.7 52.8,56.7 | v48.5,67 v42.5,67 | U2:U1.9 55.27,17.73 v55.7,18.2 | 55.85,51.95 v55.8,52 | v55.8,54.7 53.3,54.7 52.8,55.2 52.8,56.7
  Bottom 0.254: 48.4,59.9 v48.5,67 | v42.5,67 42.5,92.07 J1.1 | v55.8,54.7 v55.8,52 56.4,51.4 56.4,38.4 55.7,37.7 v55.7,18.2
DUT_MCU2_NRESET  (via drill 0.33)  (2 unrouted)
  Top 0.254: v52.42,71 v40,71
  Bottom 0.254: J1.9 v52.42,71 | v40,71 40,42.9 41.4,41.5 43.52,41.5
DUT_MCU2_SWDCLK  (via drill 0.33)  (2 unrouted)
  Top 0.254: v52.9,39.2 47.4,39.2 | 47.4,39.2 47.4,41.44 | 47.4,39.2 47.4,36.65
  Bottom 0.254: J1.7 49.88,69.92 52.9,67.4 v52.9,39.2
DUT_MCU2_SWDIO  (via drill 0.33)  (2 unrouted)
  Top 0.254: v51.6,41.5 48.67,41.5
  Bottom 0.254: v51.6,41.5 51.5,41.6 v51.5,47 52.2,47.7 52.2,67.1 48.6,69.9 48.6,93.6 47.63,94.57 J1.6
DUT_MCU2_VCC  (via drill 0.33)  (2 unrouted)
  Top 0.254: 54.05,43.75 v53.8,43.8 53.1,43.8 52.8,43.5 52.8,42.7 | 52.8,42.7 48.67,42.7 | 52.8,42.7 52.8,40.4 53.05,40.15 54.8,40.15 v54.8,37.6 | 55.3,8.45 U2:U1.4 55.3,8.51 v55.3,10.7 | 54.85,35.25 v54.8,35.2
  Bottom 0.254: v53.8,43.8 53.8,43.9 53.5,43.9 53.4,68 51,70.1 51.1,93.5 50.08,94.52 J1.8 | v54.8,37.6 v54.8,35.2 54.8,11.2 v55.3,10.7
DUT_MOTOR+  (via drill 0.33)
  Top 1: v74.3,60.6 72.1,60.6 R2.1
  Bottom 1: J1.26 74.3,93.47 v74.3,60.6
DUT_MOTOR-  (1 unrouted)
DUT_USB_5V
  Top 1: 57.5,99 28.9,99 J3.3 | 57.5,99 J1.14 | 57.5,99 130.8,99 131.3,98.5 131.3,94.65 U5:U1.9
DUT_VB  (1 unrouted)
FILLCAP  (via drill 0.33)
  Top 1: U11:U1.5 153.81,85.31 v154,85.1 | v154,62 149.53,57.6 R20.1
  Bottom 1: v154,85.1 v154,62
GND  (via drill 0.33, 0.6)  (120 unrouted)
  Top 0.254: U1:U1.3 141.55,13.15 v141.3,13.4 | U9:R28.2 v95.2,7.5 | v101.7,9.9 101.2,10.4 100.22,10.4 U9:U7.5 | v95.5,20.8 U9:R21.2 | U9:U5.5 101.17,23.43 v101.7,22.9 | v122.3,6.4 122.3,5.05 U9:R32.2 | U9:C18.2 v109,13 | v123.5,18.5 U9:R25.2 | U9:C10.2 v109,23.6 | v94.7,53.7 U9:C5.2 | v95,50.4 U9:R12.1 | v144.5,14.3 U1:C1.2 | U9:C12.2 v106.8,23 | U9:C14.2 v109,10 | v73.6,50.4 C12.2 75.1,49.95 U13.2 | 69.3,49.9 C14.2 | v158.9,22.7 R13.1 | v160.8,20.6 C10.2 | U14.63 179.25,30.5 C15.2 | v181.2,25 R19.2 | 169.7,46.9 C3.2 | C5.2 v188.7,36.5 C6.2 | 167.75,34.3 C1.2 167.8,34.5 168,34.7 U14.47 | 180.9,46.45 C2.2 180.5,46.25 180.5,45.8 179.25,44.55 U14.18 | U14.31 172.75,44.55 171.3,46 171.3,46.35 C8.2 171.3,46.6 | U14.12 183.15,39.75 183.5,40.1 184.35,40.1 C4.2 | U9:U8.2 116.81,7.21 v116.8,7.4 | v116.7,20.8 U9:U6.2 | U17.4 183.5,46.1 183.8,45.8 v183.8,45 | v190.3,54.8 C17.2
  Top 0.6: 160.36,19.01 C10.2
  Top 0.61: U9:C4.2 79.2,59.2 v79.2,57 79.2,55.9 79.81,55.29
  Top 0.813: U9:C17.2 v112,31 | U9:C19.2 v109,26.3 | C15.2 179.6,30.1 v179.6,28.9 | C4.2 C9.2
  Top 1: v69.3,50.8 69.3,49.9 | C13.2 C14.2 | v155,16.1 153.6,16.1 C11.2 | v169.7,47.7 169.7,46.9 | v188,40.8 187.9,40.8 187.4,40.3 C9.2 | v166.3,34.3 167.75,34.3 | v180.9,47.7 180.9,46.45 | v171.3,47.7 171.3,46.6 | U4:U1.4 135.03,47.73 v135,48
  other vias: 184.5,33.2 189.9,34.5 189.9,38.5 189.6,40.7 183.8,39.1
  pour Bottom: 0,0 193,0 193,100 0,100
I2C_SCL  (2 unrouted)
  Top 0.254: U1:U1.2 142.2,13.6 141.7,14.1 131.9,14.1 | 131.9,14.1 131.9,23.1 132.8,24 149,24 | 149,24 173.7,24 178.25,28.55 U14.61 | 131.9,14.1 131.9,10.9 124.6,3.6 76.1,3.6 75.1,4.6 U13.5 | 149,24 149,23.05 R15.1
I2C_SDA  (via drill 0.33)  (2 unrouted)
  Top 0.254: U1:U1.6 142.9,10.2 142.9,8.3 142.6,8 v135,8 130,3 75.2,3 74.15,3.95 U13.4 | v135,25 149,25 | 149,25 153.23,25 154.1,26 174.3,26 177.25,28.95 U14.59 | 149,25 149,25.95 R14.1
  Bottom 0.254: v135,8 v135,25
MEM_CSN  (via drill 0.33)
  Top 0.254: U14.36 166.75,40.25 v166,41 | v166,53 v184,53 184.7,53.7 R7.1 | v184,50.8 184,50.2 183.7,49.9 183.69,49.9 U17.1
  Bottom 0.254: v166,41 v166,53 | v184,53 v184,50.8
N$1
  Top 0.254: U14.2 182.45,34.75 182.7,34.5 182.7,30.15 R10.2
N$2  (1 unrouted)
N$3  (3 unrouted)
N$4  (5 unrouted)
N$5
  Top 0.254: U14.6 183.8,36.75 185.3,38.3 185.55,38.3 X1.2 185.85,38.6 186.7,39.1 188.1,39.1 C5.1
N$6
  Top 0.254: U14.5 183.75,36.25 185.1,34.9 185.55,34.9 X1.1 185.65,34.6 186.1,34.6 186.7,33.9 188.1,33.9 C6.1
N$7
  Top 0.254: U14.3 182.65,35.25 183.2,34.7 183.2,30.7 183.8,30.1 186.7,30.1 187,29.8 R16.2
N$10
  Top 0.254: U14.30 173.25,45.95 173,46.2 C8.1
N$11  (1 unrouted)
  Top 0.254: R13.2 154.9,22.7 153.55,21.35 R12.1
N$12
  Top 0.254: J8.2 176.4,15 175.5,16 R11.2
N$13
  Top 0.254: U14.4 182.85,35.75 183.7,34.9 183.7,31.3 184.3,30.7 189.5,30.7 190,30.2 R17.2
N$14
  Top 0.254: J8.3 176.39,13.01 175.4,14 168,14 R9.2
N$15  (via drill 0.33)
  Top 0.254: R10.1 184,24 182,22 v167,22 | D1.3 167.6,2.4 v167,3
  Bottom 0.254: v167,3 v167,22
N$16  (via drill 0.33)
  Top 0.254: R16.1 187,23 185,21 v169,21 | D1.1 169.35,2.65 v169,3
  Bottom 0.254: v169,3 v169,21
N$17  (via drill 0.33)
  Top 0.254: R17.1 190,22 188,20 v168,20 | D1.2 168.4,2.6 v168,3
  Bottom 0.254: v168,3 v168,20
N$18  (3 unrouted)
N$19  (3 unrouted)
N$20  (2 unrouted)
N$21  (2 unrouted)
N$22  (3 unrouted)
N$23  (1 unrouted)
N$27  (1 unrouted)
N$28  (1 unrouted)
N$29  (3 unrouted)
N$30  (1 unrouted)
N$31  (2 unrouted)
N$32  (2 unrouted)
N$33  (1 unrouted)
N$34  (1 unrouted)
N$35  (2 unrouted)
N$36  (3 unrouted)
N$38  (1 unrouted)
N$39  (2 unrouted)
N$40  (2 unrouted)
N$41  (1 unrouted)
N$42  (1 unrouted)
N$43  (2 unrouted)
N$47  (5 unrouted)
N$49  (2 unrouted)
NRESET  (via drill 0.33)
  Top 0.254: U14.7 182.55,37.25 v183,37.7 | v183,54 v154,54 | v154,9.7 157.3,9.7 162,5 162,3.8 J9.10
  Bottom 0.254: v183,37.7 v183,54 | v154,54 v154,9.7
SPI_MISO  (1 unrouted)
  Top 0.254: U14.16 182.35,41.75 182.8,42.2 182.8,44 181.7,45.1 181.7,48.2 182.1,48.56 U17.2
SPI_MOSI  (1 unrouted)
  Top 0.254: U14.15 182.55,41.25 183.3,42 183.3,43.3 184,44 189.4,44 190.3,44.9 U17.5
SPI_SCLK  (1 unrouted)
  Top 0.254: U14.14 182.75,40.75 183.8,41.8 183.8,43 184.3,43.5 190.6,43.5 192,44.9 192,46.9 191.6,47.3 190.37,47.3 U17.6
SWCLK  (via drill 0.33)
  Top 0.254: U14.49 172.25,31.25 172,31 165.4,31 v165,31.4
  Bottom 0.254: v165,31.4 165,8 163,6 159,6 158.23,5.23 J9.4
SWDIO  (via drill 0.33)
  Top 0.254: U14.46 165.25,35.25 v164,34
  Bottom 0.254: v164,34 164,9 162.1,7 158,7 156.96,5.96 J9.2
U1:INT  (via drill 0.33)
  Top 0.254: U1:U1.5 v142.2,9.1 | v142.2,15.3 141,15.3 U1:R1.1
  Bottom 0.254: v142.2,9.1 v142.2,15.3
U2:N$2
  Top 0.254: U2:U1.12 47.65,17.55 48.9,18.8 U2:Q1.3
U3:N$2
  Top 0.254: U3:U1.12 28.8,75.4 32.4,78.8 U3:Q1.3
U4:N$2
  Top 0.254: U4:Q1.3 147,36.3 146.7,36 142.8,36 142.6,36.2 142.6,38.03 U4:U1.12
U5:N$2  (via drill 0.33)
  Top 0.254: U5:U1.12 123.65,96.95 v123.7,97 | v173.1,94.9 188.05,79.95 U5:Q1.3
  Bottom 0.254: v123.7,97 171,97 v173.1,94.9
U6:INT_NRESET  (1 unrouted)
U6:INT_SWDCLK  (1 unrouted)
U6:INT_SWDIO  (1 unrouted)
U6:INT_VCC  (3 unrouted)
U6:N$1  (via drill 0.33)
  Top 0.254: U6:U3.4 54.45,53.25 54.1,52.9 54.1,50.9 | 54.1,50.9 U6:R2.1 | U6:Q1.3 v63.8,56.8 | v63.8,50.9 54.1,50.9
  Bottom 0.254: v63.8,56.8 v63.8,50.9
U6:N$2
  Top 0.254: U6:U1.4 54.3,61.45 U6:R17.1
U6:N$3  (via drill 0.33)
  Top 0.254: U6:R1.1 v54.2,54 | v54.2,58.1 56.75,58.1 U6:U2.4
  Bottom 0.254: v54.2,54 v54.2,58.1
U6:U4:N$2  (1 unrouted)
U6:U5:N$2  (1 unrouted)
U7:INT_NRESET  (1 unrouted)
U7:INT_SWDCLK  (1 unrouted)
U7:INT_SWDIO  (1 unrouted)
U7:INT_VCC  (3 unrouted)
U7:N$1  (via drill 0.33)
  Top 0.254: U7:Q1.3 v63.8,40 | v63.8,33.1 54,33.1 | 54,33.1 U7:R2.1 | U7:U3.4 54.95,36.55 54,35.6 54,33.1
  Bottom 0.254: v63.8,40 v63.8,33.1
U7:N$2
  Top 0.254: U7:U1.4 56.45,45.05 56.1,45.4 U7:R17.1
U7:N$3  (via drill 0.33)
  Top 0.254: U7:U2.4 56.25,41.45 56,41.7 v54,41.7 | v54,36.6 U7:R1.1
  Bottom 0.254: v54,41.7 v54,36.6
U7:U4:N$2  (1 unrouted)
U7:U5:N$2  (1 unrouted)
U9:N$4  (1 unrouted)
  Top 0.254: 83.64,50.99 U9:R13.2 U9:R11.1 86.9,50.35 86.9,49.8 87.6,49.1 90.4,49.1 91.55,50.25 U9:R12.2
U9:N$13
  Top 0.254: U9:R19.2 106.5,30.2 U9:L2.2
U9:N$14
  Top 0.254: U9:U5.6 104.28,24.07 U9:C11.1
U9:N$15
  Top 0.254: U9:R18.1 U9:U5.1 94.88,25.38 94.7,25.2 94.7,24.9 94.9,24.7 95.78,24.7 U9:U5.2
U9:N$16
  Top 0.254: U9:R20.2 U9:U5.8
U9:N$17
  Top 0.254: U9:U5.4 95.8,22.8 96.2,22.4 98.4,22.4 98.9,21.9 98.9,20.85 U9:R21.1 99,20.8 99.1,20.9 U9:R23.1
U9:N$18
  Top 0.254: U9:R23.2 U9:R22.1 110.15,18.6 U9:C13.2
U9:N$19
  Top 0.254: U9:R22.2 111.85,23.5 U9:C10.1 117.4,23.6 117.7,23.3 117.7,22.32 U9:U6.3
U9:N$20
  Top 0.254: 117.66,18.61 U9:R24.1 119,18.5 | 119,18.5 U9:R25.1 | U9:U6.4 118.26,24.84 119,24.1 119,18.5
U9:N$21
  Top 0.254: U9:U7.6 104.38,11.07 U9:C15.1
U9:N$22
  Top 0.254: U9:R26.1 U9:U7.1 94.88,12.38 94.7,12.2 94.7,11.9 94.9,11.7 95.78,11.7 U9:U7.2
U9:N$23
  Top 0.254: U9:R27.2 U9:U7.8
U9:N$24
  Top 0.254: U9:U7.4 95.8,9.7 96.4,9.1 98.4,9.1 98.9,8.6 98.9,7.55 U9:R28.1 U9:R30.1
U9:N$25
  Top 0.254: U9:R30.2 U9:R29.1 110.15,5.1 U9:C16.2
U9:N$26
  Top 0.254: U9:R29.2 111.85,9.9 U9:C14.1 117.5,10 117.7,9.8 117.7,8.92 U9:U8.3
U9:N$27
  Top 0.254: U9:R31.1 119.1,5 | 119.1,5 U9:R32.1 | U9:U8.4 118.46,11.44 119.1,10.8 119.1,5
U9:N$28
  Top 0.813: U9:L3.2 U9:R33.2
U9:N$35  (1 unrouted)
  Top 0.5: U9:R35.2 86,57.2 85,56.2 83.68,56.2
  Top 1: U9:R35.2 U9:RS.1
U9:SENSE_R  (via drill 0.33)
  Top 0.254: 93.8,25.7 93.8,29.5 94.45,30.15 U9:R18.2 95.85,30.1 | 93.8,25.7 93.8,17.8 94.4,17.2 95.75,17.2 U9:R26.2 | U9:R35.1 88.65,55.45 v88.7,55.4 | v88.7,25.7 93.8,25.7
  Bottom 0.254: v88.7,55.4 v88.7,25.7
U9:SENSE_S  (via drill 0.33)
  Top 0.254: U9:R27.1 v100.2,18.6 | v98,30.2 100.25,30.2 U9:R20.1 | v95.1,57.1 93.25,57.1 U9:R34.1
  Bottom 0.254: v100.2,18.6 98,20.8 v98,30.2 98,54.2 v95.1,57.1
U9:VCSA  (via drill 0.33)
  Top 0.254: U9:U7.7 101.92,11.72 103.1,12.9 104.35,12.9 U9:C15.2 v104.4,14.1 | U9:U5.7 101.12,24.73 102.3,25.9 104.25,25.9 U9:C11.2 105.4,25.95 | 105.4,25.95 U9:C12.1 U9:R19.1 | v105.5,25.3 105.5,25.85 105.4,25.95
  Bottom 0.254: v104.4,14.1 104.4,24.2 v105.5,25.3
U9:VOA  (via drill 0.33)
  Top 0.254: U9:C18.1 v114.7,13 115.4,13 115.8,12.6 115.8,11.5 U9:U8.5 | v114.7,26.3 115.3,26.3 115.7,25.9 115.7,24.9 U9:U6.5 | 114.7,30.55 U9:C17.1
  Top 0.813: U9:C19.1 v114.7,26.3 114.7,30.55 | U9:R33.1 U9:C17.1
  Bottom 0.254: v114.7,26.3 v114.7,13
U10:N$2  (1 unrouted)
U11:N$2
  Top 0.254: U11:U1.12 143.65,96.85 144.4,97.6 172.5,97.6 190.1,80 190.1,71.1 189,70 U11:Q1.3
U15:N$2  (via drill 0.33)
  Top 0.254: U15:U1.12 85.98,94.62 v86,94.6 | v175.4,98.6 192,82 192,62 190,60 U15:Q1.3
  Bottom 0.254: v86,94.6 90,98.6 v175.4,98.6
U16:N$2  (via drill 0.33)
  Top 0.254: U16:U1.12 105.42,94.62 v106,95.2 | v175,97 191,81 191,67 189,65 U16:Q1.3
  Bottom 0.254: v106,95.2 108.8,98 174,98 v175,97
U23:N$4  (3 unrouted)
U23:N$13  (1 unrouted)
U23:N$14  (1 unrouted)
U23:N$15  (2 unrouted)
U23:N$16  (1 unrouted)
U23:N$17  (2 unrouted)
U23:N$18  (2 unrouted)
U23:N$19  (2 unrouted)
U23:N$20  (2 unrouted)
U23:N$21  (1 unrouted)
U23:N$22  (2 unrouted)
U23:N$23  (1 unrouted)
U23:N$24  (2 unrouted)
U23:N$25  (2 unrouted)
U23:N$26  (2 unrouted)
U23:N$27  (2 unrouted)
U23:N$28  (1 unrouted)
U23:N$35  (2 unrouted)
U23:SENSE_R  (2 unrouted)
U23:SENSE_S  (2 unrouted)
U23:VCSA  (5 unrouted)
U23:VOA  (5 unrouted)
USB_CC_INT  (2 unrouted)
USB_DM  (via drill 0.33)  (1 unrouted)
  Top 0.254: U14.44 163.65,36.25 v162.4,35 | R11.1 v162,16
  Bottom 0.254: v162.4,35 162,34.6 v162,16
USB_DP  (via drill 0.33)  (1 unrouted)
  Top 0.254: U14.45 164.75,35.75 v163,34 | R9.1 v163,13
  Bottom 0.254: v163,34 v163,13
USB_VBUS  (via drill 0.33)  (3 unrouted)
  Top 0.254: 160.85,17.5 C10.1 | 157.46,19.96 157.2,19.7 157.2,16.4 157.7,15.9 159.1,15.9 159.6,16.4 159.6,18.06 | U14.42 163.25,37.25 v161,35 | 27.2,69 v78,69 | 104.2,34.94 104.2,35
  Top 0.6: 159.6,18.06 160.29,18.06 C10.1
  Top 0.61: 81.15,60.35 80.5,61 v78,61
  Top 1: J8.1 178.95,18.3 | 178.5,18.5 163.2,18.5 | 163.2,18.5 162.2,17.5 160.85,17.5 | v161.1,22 162.5,22 163.2,21.3 163.2,18.5 | v161,35 104.2,35 v78,35
  Bottom 0.254: v78,69 v78,61
  Bottom 1: v161,35 v161.1,22 | v78,61 v78,35
USBADJ  (5 unrouted)

## Text on the board
_tsilk: Firefly Instruments / Revision 0.5 2017/03/01 / Copyright Firefly Design LLC | U6 | U9.1 | U7 | U9.2 | U1